# EAGLE design SENSEBREAST (EAGLE 9.5.0)
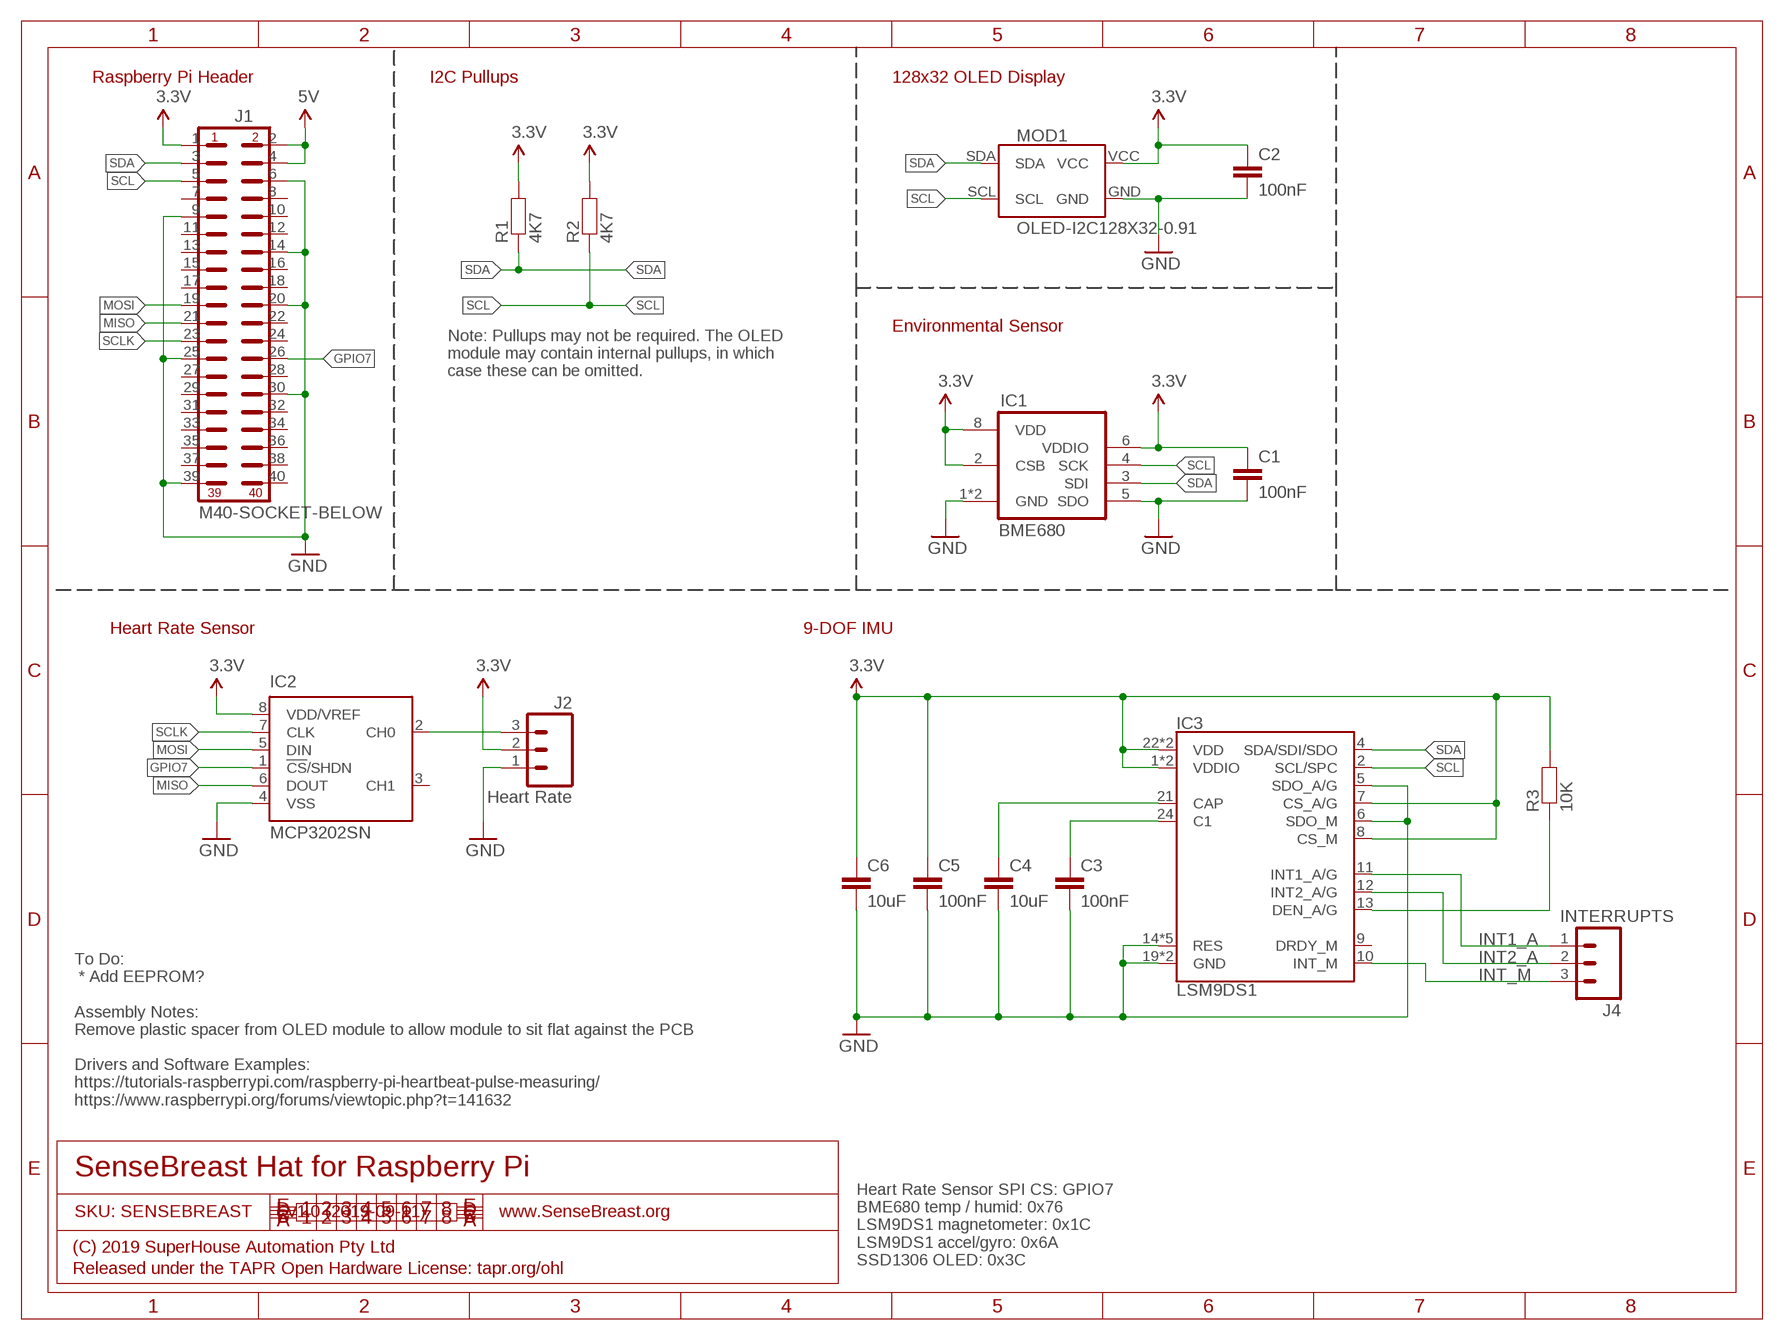
[diagram p0: schematic, sheet 1]

## Parts
C1  100nF  CAP0603  [C0603]
C2  100nF  CAP0603  [C0603]
C3  100nF  CAP0603  [C0603]
C4  10uF  CAP0805  [C0805]
C5  100nF  CAP0603  [C0603]
C6  10uF  CAP0805  [C0805]
IC1  BME680  [BME680]
IC2  MCP3202SN  [SO-08]
IC3  LSM9DS1  [LGA24-8X4]
J1  M40-SOCKET-BELOW  [2X20-S-BELOW]
J2  Heart Rate  M03-SOCKET-RIGHTANGLE  [1X03-S-RA]
J4  INTERRUPTS  M03-PLAIN  [1X03]
MOD1  OLED-I2C128X32-0.91  [OLED-128X32-0.91]
R1  4K7  RESISTOR0603  [R0603]
R2  4K7  RESISTOR0603  [R0603]
R3  10K  RESISTOR0603  [R0603]

## Nets
3.3V: C1.1 C2.1 C5.1 C6.1 IC1.2(CSB) IC1.6(VDDIO) IC1.8(VDD) IC2.8(VDD/VREF) IC3.1(VDDIO) IC3.3(VDDIO) IC3.7(CS_A/G) IC3.8(CS_M) IC3.22(VDD) IC3.23(VDD) J1.1 J2.2 MOD1.VCC R1.2 R2.2 R3.2
5V: J1.2 J1.4
GND: C1.2 C2.2 C3.2 C4.2 C5.2 C6.2 IC1.1(GND) IC1.5(SDO) IC1.7(GND) IC2.4(VSS) IC3.5(SDO_A/G) IC3.6(SDO_M) IC3.14(RES) IC3.15(RES) IC3.16(RES) IC3.17(RES) IC3.18(RES) IC3.19(GND) IC3.20(GND) J1.6 J1.9 J1.14 J1.20 J1.25 J1.30 J1.39 J2.1 MOD1.GND
GPIO7: IC2.1(!CS!/SHDN) J1.26
INT1_A: IC3.11(INT1_A/G) J4.1
INT2_A: IC3.12(INT2_A/G) J4.2
INT_M: IC3.10(INT_M) J4.3
MISO: IC2.6(DOUT) J1.21
MOSI: IC2.5(DIN) J1.19
N$1: IC2.2(CH0) J2.3
N$4: IC3.13(DEN_A/G) R3.1
N$7: C3.1 IC3.24(C1)
N$8: C4.1 IC3.21(CAP)
SCL: IC1.4(SCK) IC3.2(SCL/SPC) J1.5 MOD1.SCL R2.1
SCLK: IC2.7(CLK) J1.23
SDA: IC1.3(SDI) IC3.4(SDA/SDI/SDO) J1.3 MOD1.SDA R1.1
Unconnected: IC2.3(CH1) IC3.9(DRDY_M) J1.7 J1.8 J1.10 J1.11 J1.12 J1.13 J1.15 J1.16 J1.17 J1.18 J1.22 J1.24 J1.27 J1.28 J1.29 J1.31 J1.32 J1.33 J1.34 J1.35 J1.36 J1.37 J1.38 J1.40

## Notes on the sheet
- Raspberry Pi Header | I2C Pullups | 128x32 OLED Display
- Environmental Sensor
- Note: Pullups may not be required. The OLED
  module may contain internal pullups, in which
  case these can be omitted.
- Heart Rate Sensor | 9-DOF IMU
- To Do:
   * Add EEPROM?
  
  Assembly Notes:
  Remove plastic spacer from OLED module to allow module to sit flat against the PCB
  
  Drivers and Software Examples:
  https://tutorials-raspberrypi.com/raspberry-pi-heartbeat-pulse-measuring/
  https://www.raspberrypi.org/forums/viewtopic.php?t=141632
- SenseBreast Hat for Raspberry Pi
- SKU: SENSEBREAST | v1.0 (2019-09-11) | www.SenseBreast.org
- (C) 2019 SuperHouse Automation Pty Ltd
- Heart Rate Sensor SPI CS: GPIO7
  BME680 temp / humid: 0x76
  LSM9DS1 magnetometer: 0x1C
  LSM9DS1 accel/gyro: 0x6A
  SSD1306 OLED: 0x3C
- Released under the TAPR Open Hardware License: tapr.org/ohl

## Library data of the parts
C1-C6 = SuperHouse-DiscreteSemi:CAP: Capacitor Standard ceramic capacitor
IC1 = SuperHouse-Sensors:BME680: BME680 humdity, pressure, temperature, and gas sensor
IC2 = SuperHouse-ICs:MCP3202: 2.7V Dual Channel 12-Bit A/D Converter with SPI Serial Interface Source: http://ww1.microchip.com/downloads/en/DeviceDoc/21034D.pdf; MF: MICROCHIP; MPN: MCP3202-CI/SN; OC_FARNELL: 1196803; OC_NEWARK: 19C7207
IC3 = SuperHouse-Sensors:LSM9DS1: LSM9DS1 3D accelerometer, gyroscope & magnetometer The LSM9DS1 is a system-in-package featuring a 3D digital linear acceleration sensor, a 3D digital angular rate sensor, and a 3D digital magnetic sensor. The LSM9DS1 has a linear acceleration full scale of ±2g/±4g/±8/±16 g, a magnetic field full scale of ±4/±8/±12/±16 gauss and an angular rate of ±245/±500/±2000 dps. The LSM9DS1 includes an I2 C serial bus interface supporting standard and fast mode (100 kHz and 400 kHz) and an SPI serial standard interface. Magnetic, accelerometer and gyroscope sensing can be enabled or set in power-down mode separately for smart power management. The LSM9DS1 is available in a plastic land grid array package (LGA) and it is guaranteed to operate over an extended temperature range from -40 °C to +85 °C.; PROD_ID: IC-12536
J1 = SuperHouse-Connectors:M40: 40-way header
J2 J4 = SuperHouse-Connectors:M03: 3-way header Standard 1x3 header, and screw terminal variations
MOD1 = SuperHouse-Displays:OLED-I2C: OLED module with SSD1306 I2C driver
R1-R3 = SuperHouse-DiscreteSemi:RESISTOR: Resistor Standard resistors.

## Board
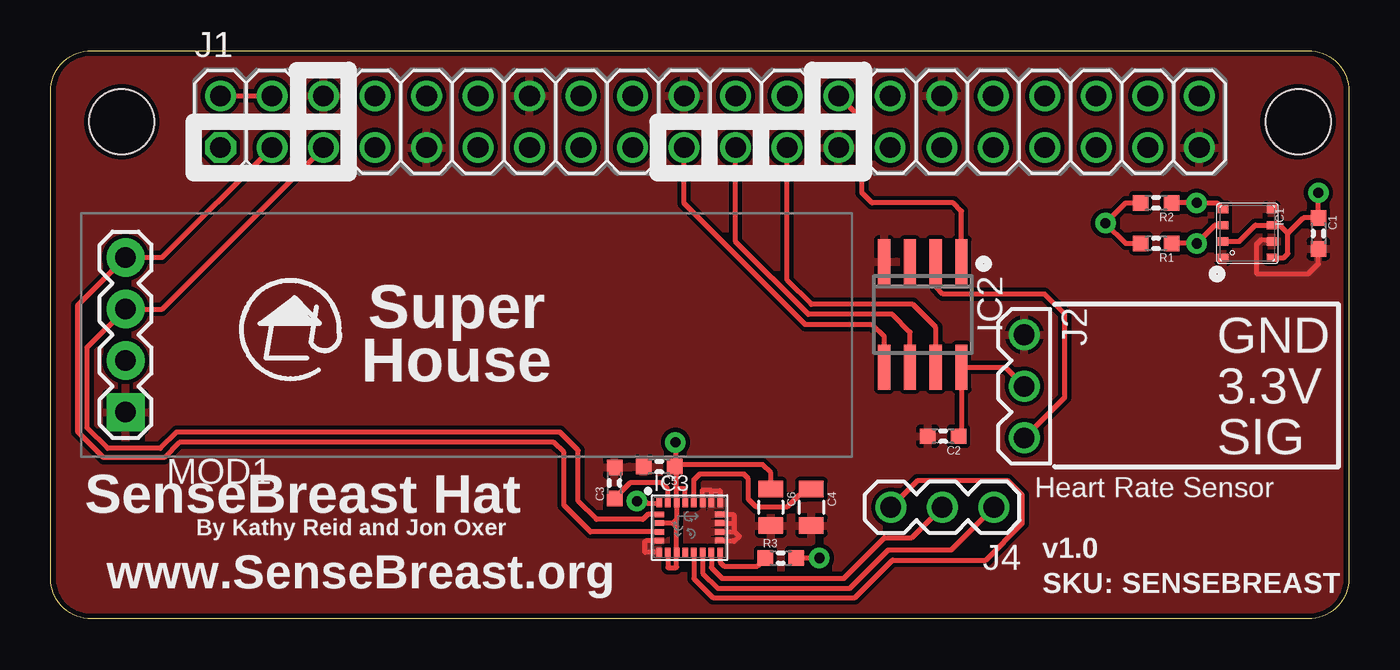
[diagram p1: board, top side]
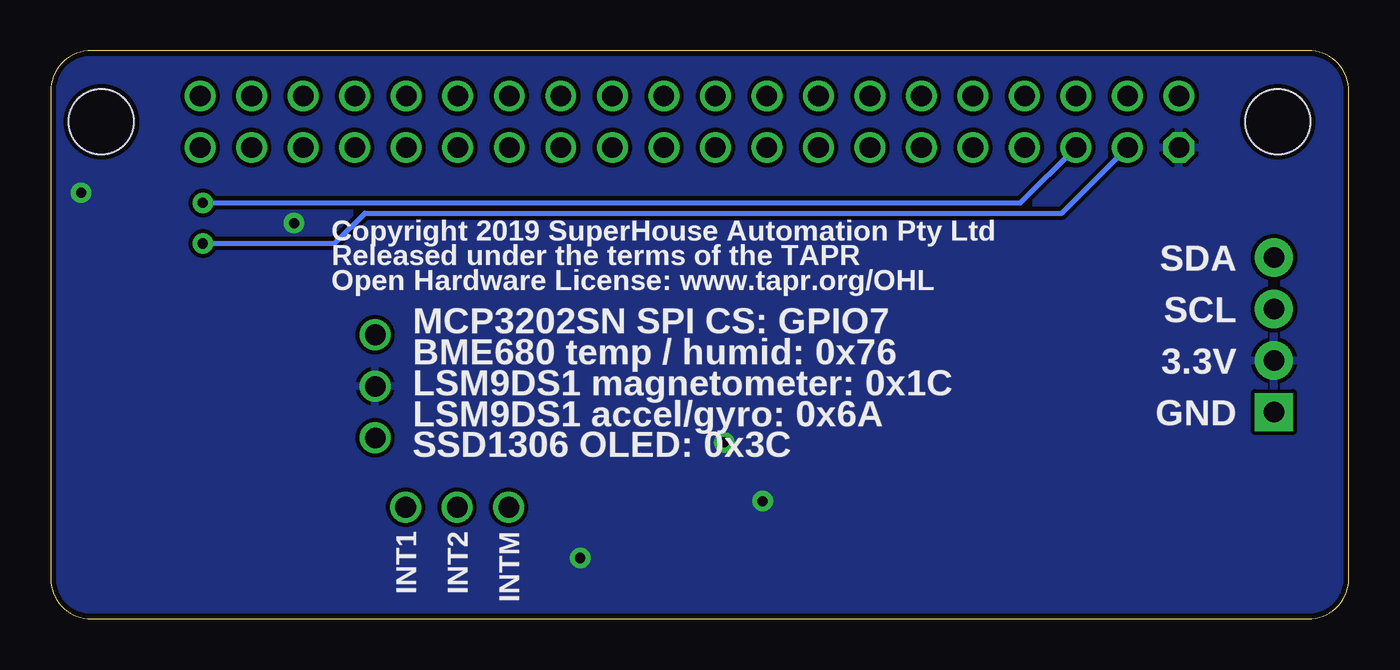
[diagram p2: board, bottom side, seen from below]

Size 64 x 28 mm. Coordinates in mm from the lower left corner, seen from the top.
Outline: 0,26 arc-90 2,28 62,28 arc-90 64,26 64,2 arc-90 62,0 2,0 arc-90 0,2 0,26
Copper layers (1*16): Top 0.035mm / dielectric 1.5mm / Bottom 0.035mm
Design rules "default *": minimum track width 8mil, minimum drill 0.4mm, track to track 8mil, track to pad 8mil, pad to pad 8mil, via to via 8mil, smd to smd 8mil, copper to edge 10mil, drill to drill 8mil, minimum pad ring 8mil, minimum via ring 10mil, stop-mask expansion 3mil, vias tented up to drill 25mil, thermal gap 8mil
Holes 3.2 mm at 3.5,24.5 61.5,24.5

### Footprints (pad centres in the part's own frame; a part is rotated, then mirrored left to right if it is on the bottom)
C0603 = smd 0.762 x 0.762: 1 -0.762,0; 2 0.762,0
C0805 = smd 0.8 x 1.2: 1 -0.9,0; 2 0.9,0
BME680 = smd 0.4 x 0.5: 1 1.2,-1.2; 2 0.4,-1.2; 3 -0.4,-1.2; 4 -1.2,-1.2; 5 -1.2,1.2; 6 -0.4,1.2; 7 0.4,1.2; 8 1.2,1.2
SO-08 = smd 0.6 x 2.2: 1 -1.905,-2.6; 2 -0.635,-2.6; 3 0.635,-2.6; 4 1.905,-2.6; 5 1.905,2.6; 6 0.635,2.6; 7 -0.635,2.6; 8 -1.905,2.6
LGA24-8X4 = smd 0.27 x 0.45: 1 -1.505,1.225; 6 -1.505,-1.225; 7 -1.075,-1.225; 8 -0.645,-1.225; 9 -0.215,-1.225; 10 0.215,-1.225; 11 0.645,-1.225; 12 1.075,-1.225; 13 1.505,-1.225; 18 1.505,1.225; 19 1.075,1.225; 20 0.645,1.225; 21 0.215,1.225; 22 -0.215,1.225; 23 -0.645,1.225; 24 -1.075,1.225 | smd 0.45 x 0.27: 2 -1.475,0.645; 3 -1.475,0.215; 4 -1.475,-0.215; 5 -1.475,-0.645; 14 1.475,-0.645; 15 1.475,-0.215; 16 1.475,0.215; 17 1.475,0.645
2X20-S-BELOW = drill 1.016 octagon: 1 0,0 | drill 1.016: 2 0,2.54; 3 2.54,0; 4 2.54,2.54; 5 5.08,0; 6 5.08,2.54; 7 7.62,0; 8 7.62,2.54; 9 10.16,0; 10 10.16,2.54; 11 12.7,0; 12 12.7,2.54; 13 15.24,0; 14 15.24,2.54; 15 17.78,0; 16 17.78,2.54; 17 20.32,0; 18 20.32,2.54; 19 22.86,0; 20 22.86,2.54; 21 25.4,0; 22 25.4,2.54; 23 27.94,0; 24 27.94,2.54; 25 30.48,0; 26 30.48,2.54; 27 33.02,0; 28 33.02,2.54; 29 35.56,0; 30 35.56,2.54; 31 38.1,0; 32 38.1,2.54; 33 40.64,0; 34 40.64,2.54; 35 43.18,0; 36 43.18,2.54; 37 45.72,0; 38 45.72,2.54; 39 48.26,0; 40 48.26,2.54
1X03-S-RA = drill 1.016: 1 0,0; 2 2.54,0; 3 5.08,0
1X03 = drill 1.016: 1 0,0; 2 2.54,0; 3 5.08,0
OLED-128X32-0.91 = drill 1.016 pad 1.88 square: GND -19.31,-3.81 | drill 1.016 pad 1.88: SCL -19.31,1.27; SDA -19.31,3.81; VCC -19.31,-1.27
R0603 = smd 0.762 x 0.762: 1 -0.762,0; 2 0.762,0

### Placement (x,y rotation side)
C1  62.5,19 270 top
C2  44,9 180 top
C3  27.8,6.7 90 top
C4  37.5,5.5 270 top
C5  30,7.5 180 top
C6  35.5,5.5 270 top
IC1  59,19 270 top
IC2  43,15 180 top
IC3  31.5,4.5 0 top
J1  8.37,23.23 0 top
J2  48,14 270 top
J4  46.5,5.5 180 top
MOD1  23,14 0 top
R1  54.5,18.5 180 top
R2  54.5,20.5 180 top
R3  36,3 0 top

### Tracks (layer width: path | path; a pad name or v marks a point on that pad's centre or on a via)
3.3V  (via drill 0.5)
  Top 0.254: C2.1 44.91,9.14 IC2.8 47.06,12.4 J2.2 | 61,19 61.76,19.76 C1.1 v62.5,21 | R1.2 53,18.5 v52,19.5 53,20.5 R2.2 | 30.68,4.71 IC3.3 | 30.86,6.4 IC3.23 30.86,4.88 30.68,4.71 | 30.86,6.4 30.86,7.41 | 30.86,7.41 C5.1 30.8,7.54 v30.8,8.7 | C6.1 35.5,7.2 35.1,7.6 31.05,7.6 30.86,7.41 | IC3.1 29.97,5.7 29.4,5.7 29.3,5.8 v28.9,5.8 | 30.68,4.71 30.86,4.54 IC3.8 30.86,2.56 30.82,2.52 30.43,2.52 IC3.7 | R3.2 v37.9,3 | IC1.8 60.8,17.8 61,18 61,19 | 61,19 60.6,19.4 IC1.6 59.4,19.4 58.6,18.6 IC1.2 | IC3.22 31.29,6.38 31.27,6.4 30.86,6.4
  pour Bottom: 2,28.32 61.94,28.32 arc-90 63.94,26.32 63.94,2 arc-90 61.94,0 2,0 arc-90 0,2 0,26.32 arc-90
5V
  Top 0.254: J1.2 J1.4
GND
  Top 0.254: IC1.7 59.67,18.68 59.45,18.45 59.45,17.05 59.5,17 62,17 62.5,17.5 C1.2 | IC3.14 33.65,3.85 33.7,3.8 33.95,4.05 33.72,4.29 | IC3.15 33.72,4.29 | IC3.16 33.62,4.71 33.7,4.8 | 33.7,4.8 33.7,5.1 33.66,5.14 IC3.17 | 33.7,4.8 33.7,4.3 33.72,4.29 | IC3.18 33,6.3 32.98,6.33 32.58,6.33 | IC3.19 32.58,6.33 | IC3.20 32.15,6.36 32.55,6.36 32.58,6.33 | IC3.5 29.36,3.85 29.3,3.8 29.3,3.3 29.32,3.27 IC3.6
  pour Top: 2,28 64,28 64,0 2,0 arc-90 0,2 0,26 arc-90
GPIO7
  Top 0.254: IC2.1 44.91,20.09 44.5,20.5 40.5,20.5 40,21 40,24.62 J1.26
INT1_A
  Top 0.254: IC3.11 32.15,2.25 32.9,1.5 39.4,1.5 41.3,3.4 44.4,3.4 J4.1
INT2_A
  Top 0.254: IC3.12 32.58,2.52 33.1,2 39.1,2 41.1,4 42.46,4 J4.2
INT_M
  Top 0.254: IC3.10 31.71,1.99 32.66,1.04 39.64,1.04 41.5,2.9 46.1,2.9 47.9,4.7 47.9,6.1 47.2,6.8 42.72,6.8 J4.3
MISO
  Top 0.254: IC2.6 42.37,14.13 41.5,15 37.35,15 33.77,18.58 J1.21
MOSI
  Top 0.254: IC2.5 41.09,13.9 40.5,14.5 37.21,14.5 31.23,20.48 J1.19
N$1
  Top 0.254: J2.3 50,10.92 50,15 49,16 44,16 43.63,16.36 IC2.2
N$4
  Top 0.254: R3.1 34.84,2.6 33.2,2.6 33.01,2.79 IC3.13
N$7
  Top 0.254: C3.1 28.56,6.7 30.1,6.7 30.43,6.38 IC3.24
N$8
  Top 0.254: C4.1 37.2,6.1 36.9,6.1 36.3,5.5 34.8,5.5 34.4,5.9 34.4,6.9 34.16,7.14 32,7.14 31.71,6.86 IC3.21
SCL  (via drill 0.5)
  Top 0.254: J1.5 5.49,15.27 MOD1.SCL 1.8,13.38 1.8,9.4 2.8,8.4 5.4,8.4 6.2,9.2 25.1,9.2 26,8.3 26,5.8 26.9,4.9 29.2,4.9 29.45,5.14 IC3.2 | R2.1 v56.5,20.5 57.5,20.5 IC1.4
  Bottom 0.254: J1.5 16.18,20.5 v56.5,20.5
SCLK
  Top 0.254: IC2.7 43.63,14.37 42.5,15.5 37.5,15.5 36.31,16.69 J1.23
SDA  (via drill 0.5)
  Top 0.254: J1.3 5.49,17.81 MOD1.SDA 1.34,15.46 1.34,9.21 2.61,7.94 5.59,7.94 6.35,8.7 24.8,8.7 25.3,8.2 25.3,5.6 26.61,4.29 IC3.4 | R1.1 v56.5,18.5 57.4,19.4 IC1.3
  Bottom 0.254: J1.3 14.14,20 48.5,20 50,18.5 v56.5,18.5

### Text on the board
tPlace: Super / House | GND | 3.3V | SIG | Heart Rate Sensor | SenseBreast Hat | By Kathy Reid and Jon Oxer | v1.0 | www.SenseBreast.org | SKU: SENSEBREAST
bPlace: SDA | Copyright 2019 SuperHouse Automation Pty Ltd / Released under the terms of the TAPR / Open Hardware License: www.tapr.org/OHL | SCL | 3.3V | GND | MCP3202SN SPI CS: GPIO7 / BME680 temp / humid: 0x76 / LSM9DS1 magnetometer: 0x1C / LSM9DS1 accel/gyro: 0x6A / SSD1306 OLED: 0x3C | INTM | INT2 | INT1